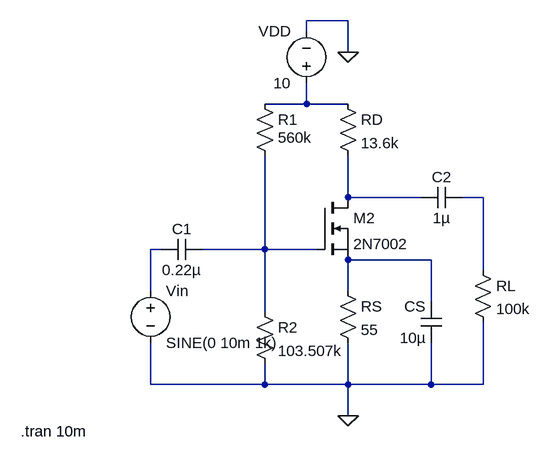
[diagram p0: schematic NNM24EE034_Danish.asc]
NNM24EE034_Danish.asc, the LTspice schematic file:
Version 4.1
SHEET 1 904 680
WIRE 256 -144 192 -144
WIRE 192 -128 192 -144
WIRE 256 -96 256 -144
WIRE 192 -16 192 -48
WIRE 192 -16 128 -16
WIRE 256 -16 192 -16
WIRE 256 128 256 64
WIRE 368 128 256 128
WIRE 464 128 432 128
WIRE -32 208 -48 208
WIRE 128 208 128 64
WIRE 128 208 32 208
WIRE 208 208 128 208
WIRE 384 224 256 224
WIRE 464 240 464 128
WIRE -48 272 -48 208
WIRE 256 272 256 224
WIRE 384 288 384 224
WIRE 128 304 128 208
WIRE -48 416 -48 352
WIRE 128 416 128 384
WIRE 128 416 -48 416
WIRE 256 416 256 352
WIRE 256 416 128 416
WIRE 384 416 384 352
WIRE 384 416 256 416
WIRE 464 416 464 320
WIRE 464 416 384 416
WIRE 256 464 256 416
FLAG 256 464 0
FLAG 256 -96 0
SYMBOL res 112 288 R0
SYMATTR InstName R2
SYMATTR Value 103.507k
SYMBOL res 240 -32 R0
SYMATTR InstName RD
SYMATTR Value 13.6k
SYMBOL res 240 256 R0
SYMATTR InstName RS
SYMATTR Value 55
SYMBOL res 112 -32 R0
WINDOW 3 36 68 Left 2
SYMATTR Value 560k
SYMATTR InstName R1
SYMBOL cap 32 192 R90
WINDOW 0 0 32 VBottom 2
WINDOW 3 32 32 VTop 2
SYMATTR InstName C1
SYMATTR Value 0.22µ
SYMBOL cap 432 112 R90
WINDOW 0 0 32 VBottom 2
WINDOW 3 32 32 VTop 2
SYMATTR InstName C2
SYMATTR Value 1µ
SYMBOL cap 400 352 R180
WINDOW 0 24 56 Left 2
WINDOW 3 24 8 Left 2
SYMATTR InstName CS
SYMATTR Value 10µ
SYMBOL res 448 224 R0
SYMATTR InstName RL
SYMATTR Value 100k
SYMBOL voltage 192 -32 R180
WINDOW 0 24 96 Left 2
WINDOW 3 24 16 Left 2
WINDOW 123 0 0 Left 0
WINDOW 39 0 0 Left 0
SYMATTR InstName VDD
SYMATTR Value 10
SYMBOL voltage -48 256 R0
WINDOW 123 24 124 Left 2
WINDOW 39 0 0 Left 0
SYMATTR InstName Vin
SYMATTR Value SINE(0 10m 1k)
SYMBOL nmos 208 128 R0
SYMATTR InstName M2
SYMATTR Value 2N7002
TEXT -248 488 Left 2 !.tran 10m

The netlist it stands for:
* NNM24EE034_Danish.asc
R2 N005 0 103.507k
RD N001 N002 13.6k
RS N006 0 55
R1 N001 N005 560k
C1 N005 N004 0.22µ
C2 N003 N002 1µ
CS 0 N006 10µ
RL N003 0 100k
VDD N001 0 10
Vin N004 0 SINE(0 10m 1k)
M2 N002 N005 N006 N006 2N7002
.model NMOS NMOS
.model PMOS PMOS
.lib standard.mos
.tran 10m
.backanno
.end